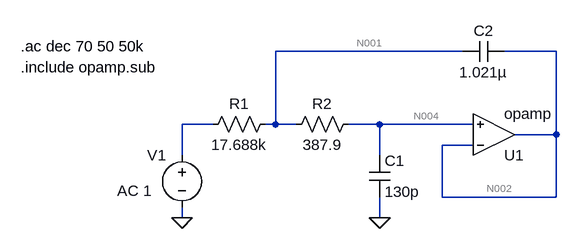
[diagram p0: schematic Draft2.asc]
Draft2.asc, the LTspice schematic file:
Version 4
SHEET 1 880 680
WIRE 400 -16 112 -16
WIRE 544 -16 464 -16
WIRE 16 96 -32 96
WIRE 112 96 112 -16
WIRE 112 96 96 96
WIRE 144 96 112 96
WIRE 272 96 224 96
WIRE 416 96 272 96
WIRE 544 112 544 -16
WIRE 544 112 480 112
WIRE 416 128 368 128
WIRE -32 144 -32 96
WIRE 272 144 272 96
WIRE 368 208 368 128
WIRE 544 208 544 112
WIRE 544 208 368 208
WIRE -32 240 -32 224
WIRE 272 240 272 208
FLAG -32 240 0
FLAG 272 240 0
SYMBOL res 112 80 R90
WINDOW 0 0 56 VBottom 2
WINDOW 3 32 56 VTop 2
SYMATTR InstName R1
SYMATTR Value 17.688k
SYMBOL res 240 80 R90
WINDOW 0 0 56 VBottom 2
WINDOW 3 32 56 VTop 2
SYMATTR InstName R2
SYMATTR Value 387.9
SYMBOL cap 256 144 R0
SYMATTR InstName C1
SYMATTR Value 130p
SYMBOL cap 464 -32 R90
WINDOW 0 0 32 VBottom 2
WINDOW 3 32 32 VTop 2
SYMATTR InstName C2
SYMATTR Value 1.021µ
SYMBOL voltage -32 128 M0
WINDOW 3 50 68 Left 2
WINDOW 123 46 70 Left 2
WINDOW 39 0 0 Left 0
SYMATTR Value ""
SYMATTR Value2 AC 1
SYMATTR InstName V1
SYMBOL Opamps\\opamp 448 176 M180
SYMATTR InstName U1
TEXT -280 -24 Left 2 !.ac dec 70 50 50k
TEXT -280 8 Left 2 !.include opamp.sub

The netlist it stands for:
* Draft2.asc
R1 N001 N003 17.688k
R2 N004 N001 387.9
C1 N004 0 130p
C2 N002 N001 1.021µ
V1 N003 0 AC 1
XU1 N002 N004 N002 opamp Aol=100K GBW=10Meg  ; pins invin noninvin out
.ac dec 70 50 50k
.include opamp.sub
.backanno
.end

* Results of the author's LTspice run, read from the files saved beside the schematic
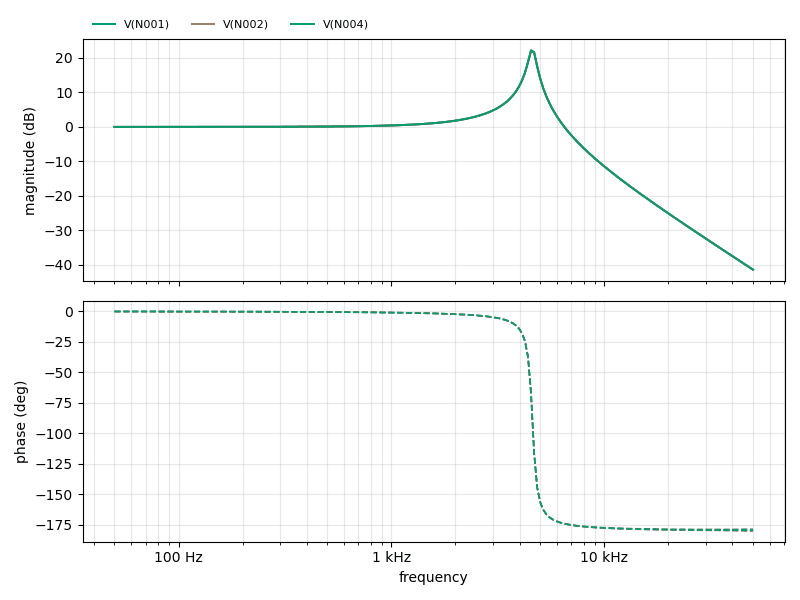
[diagram p1: AC Analysis of Draft2.asc, plotted from the saved traces]
* AC Analysis, 1 run:
*   V(N001): 0.00 dB at 50 Hz, -41.38 dB at 50 kHz, peak 22.17 dB at 4.53 kHz, 3 dB below the peak at 4.399 kHz and 4.776 kHz
*   V(N002): 0.00 dB at 50 Hz, -41.38 dB at 50 kHz, peak 22.17 dB at 4.53 kHz, 3 dB below the peak at 4.399 kHz and 4.776 kHz
*   V(N004): 0.00 dB at 50 Hz, -41.38 dB at 50 kHz, peak 22.17 dB at 4.53 kHz, 3 dB below the peak at 4.399 kHz and 4.776 kHz